# EAGLE design BasicGates2 (EAGLE 9.6.2)
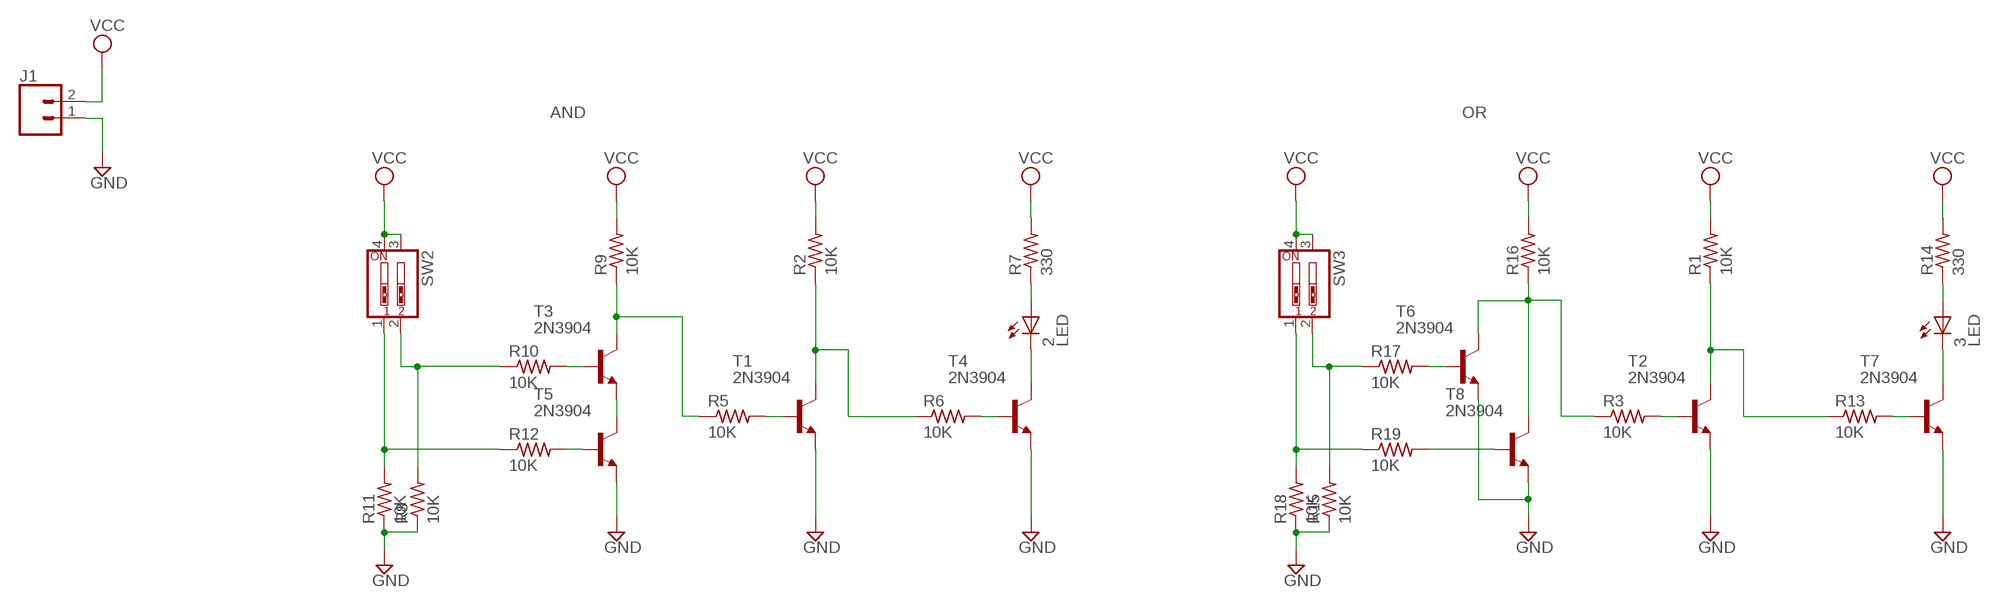
[diagram p0: schematic, sheet 1]

## Parts
2  LED  LED5MM  [LED5MM]
3  LED  LED5MM  [LED5MM]
J1  CONN_02  [1X02]
R1  10K  R-US_0309/10  [0309/10]
R2  10K  R-US_0309/10  [0309/10]
R3  10K  R-US_0309/10  [0309/10]
R5  10K  R-US_0309/10  [0309/10]
R6  10K  R-US_0309/10  [0309/10]
R7  330  R-US_0309/10  [0309/10]
R8  10K  R-US_0309/10  [0309/10]
R9  10K  R-US_0309/10  [0309/10]
R10  10K  R-US_0309/10  [0309/10]
R11  10K  R-US_0309/10  [0309/10]
R12  10K  R-US_0309/10  [0309/10]
R13  10K  R-US_0309/10  [0309/10]
R14  330  R-US_0309/10  [0309/10]
R15  10K  R-US_0309/10  [0309/10]
R16  10K  R-US_0309/10  [0309/10]
R17  10K  R-US_0309/10  [0309/10]
R18  10K  R-US_0309/10  [0309/10]
R19  10K  R-US_0309/10  [0309/10]
SW2  SW_DIP-2  [EDG-02]
SW3  SW_DIP-2  [EDG-02]
T1  2N3904  [TO92]
T2  2N3904  [TO92]
T3  2N3904  [TO92]
T4  2N3904  [TO92]
T5  2N3904  [TO92]
T6  2N3904  [TO92]
T7  2N3904  [TO92]
T8  2N3904  [TO92]

## Nets
GND: J1.1 R8.1 R11.1 R15.1 R18.1 T1.3(E) T2.3(E) T4.3(E) T5.3(E) T6.3(E) T7.3(E) T8.3(E)
N$1: R2.1 R6.1 T1.1(C)
N$2: R5.2 T1.2(B)
N$3: R1.1 R13.1 T2.1(C)
N$4: R6.2 T4.2(B)
N$5: 2.A R7.1
N$6: 2.K(C) T4.1(C)
N$7: R5.1 R9.1 T3.1(C)
N$8: R10.2 T3.2(B)
N$9: R8.2 R10.1 SW2.2
N$10: T3.3(E) T5.1(C)
N$11: R12.2 T5.2(B)
N$12: R11.2 R12.1 SW2.1
N$13: R13.2 T7.2(B)
N$14: 3.A R14.1
N$15: 3.K(C) T7.1(C)
N$16: R3.1 R16.1 T6.1(C) T8.1(C)
N$17: R17.2 T6.2(B)
N$18: R15.2 R17.1 SW3.2
N$19: R3.2 T2.2(B)
N$20: R19.2 T8.2(B)
N$21: R18.2 R19.1 SW3.1
VCC: J1.2 R1.2 R2.2 R7.2 R9.2 R14.2 R16.2 SW2.3 SW2.4 SW3.3 SW3.4

## Notes on the sheet
- AND | OR

## Library data of the parts
2 3 = led:LED: LED OSRAM: - CHIPLED LG R971, LG N971, LY N971, LG Q971, LY Q971, LO R971, LY R971 LH N974, LH R974 LS Q976, LO Q976, LY Q976 LO Q996 - Hyper CHIPLED LW Q18S LB Q993, LB Q99A, LB R99A - SideLED LS A670, LO A670, LY A670, LG A670, LP A670 LB A673, LV A673, LT A673, LW A673 LH A674 LY A675 LS A676, LA A676, LO A676, LY A676, LW A676 LS A679, LY A679, LG A679 - Hyper Micro SIDELED® LS Y876, LA Y876, LO Y876, LY Y876 LT Y87S - SmartLED LW L88C, LW L88S LB L89C, LB L89S, LG L890 LS L89K, LO L89K, LY L89K LS L896, LA L896, LO L896, LY L896 - TOPLED LS T670, LO T670, LY T670, LG T670, LP T670 LSG T670, LSP T670, LSY T670, LOP T670, LYG T670 LG T671, LOG T671, LSG T671 LB T673, LV T673, LT T673, LW T673 LH T674 LS T676, LA T676, LO T676, LY T676, LB T676, LH T676, LSB T676, LW T676 LB T67C, LV T67C, LT T67C, LS T67K, LO T67K, LY T67K, LW E67C LS E67B, LA E67B, LO E67B, LY E67B, LB E67C, LV E67C, LT E67C LW T67C LS T679, LY T679, LG T679 LS T770, LO T770, LY T770, LG T770, LP T770 LB T773, LV T773, LT T773, LW T773 LH T774 LS E675, LA E675, LY E675, LS T675 LS T776, LA T776, LO T776, LY T776, LB T776 LHGB T686 LT T68C, LB T68C - Hyper Mini TOPLED® LB M676 - Mini TOPLED Santana® LG M470 LS M47K, LO M47K, LY M47K Source: http://www.osram.convergy.de LUXEON: - LUMILED® LXK2-PW12-R00, LXK2-PW12-S00, LXK2-PW14-U00, LXK2-PW14-V00 LXK2-PM12-R00, LXK2-PM12-S00, LXK2-PM14-U00 LXK2-PE12-Q00, LXK2-PE12-R00, LXK2-PE12-S00, LXK2-PE14-T00, LXK2-PE14-U00 LXK2-PB12-K00, LXK2-PB12-L00, LXK2-PB12-M00, LXK2-PB14-N00, LXK2-PB14-P00, LXK2-PB14-Q00 LXK2-PR12-L00, LXK2-PR12-M00, LXK2-PR14-Q00, LXK2-PR14-R00 LXK2-PD12-Q00, LXK2-PD12-R00, LXK2-PD12-S00 LXK2-PH12-R00, LXK2-PH12-S00 LXK2-PL12-P00, LXK2-PL12-Q00, LXK2-PL12-R00 Source: www.luxeon.com KINGBRIGHT: KA-3528ASYC Source: www.kingbright.com
J1 = SparkFun-Connectors:CONN_02: Multi connection point. Often used as Generic Header-pin footprint for 0.1 inch spaced/style header connections On any of the 0.1 inch spaced packages, you can populate with these: Break Away Headers - Straight <https://www.sparkfun.com/products/116> (PRT-00116) Break Away Male Headers - Right Angle <https://www.sparkfun.com/products/553> (PRT-00553) Female Headers <https://www.sparkfun.com/products/115> (PRT-00115) Break Away Headers - Machine Pin <https://www.sparkfun.com/products/117> (PRT-00117) Break Away Female Headers - Swiss Machine Pin <https://www.sparkfun.com/products/743> (PRT-00743) For SCREWTERMINALS and SPRING TERMINALS visit here: Screw Terimnals on SparkFun.com <https://www.sparkfun.com/search/results?term=Screw+Terminals> (5mm/3.5mm/2.54mm spacing) This device is also useful as a general connection point to wire up your design to another part of your project. Our various solder wires solder well into these plated through hole pads. Hook-Up Wire - Assortment (Stranded, 22 AWG) <https://www.sparkfun.com/products/11375> (PRT-11375) Hook-Up Wire - Assortment (Solid Core, 22 AWG) <https://www.sparkfun.com/products/11367> (PRT-11367) View the entire wire category on our website here <https://www.sparkfun.com/categories/141> Special notes: Molex polarized connector foot print use with: PRT-08233 with associated crimp pins and housings. 2.54_SCREWTERM for use with PRT-10571. 3.5mm Screw Terminal footprints for PRT-08084 5mm Screw Terminal footprints for use with PRT-08432
R1-R3 R5-R19 = resistor:R-US_: RESISTOR, American symbol
SW2 SW3 = special:SW_DIP-2: DIP SWITCH
T1-T8 = transistor:2N3904: NPN TRANSISTOR

## Board
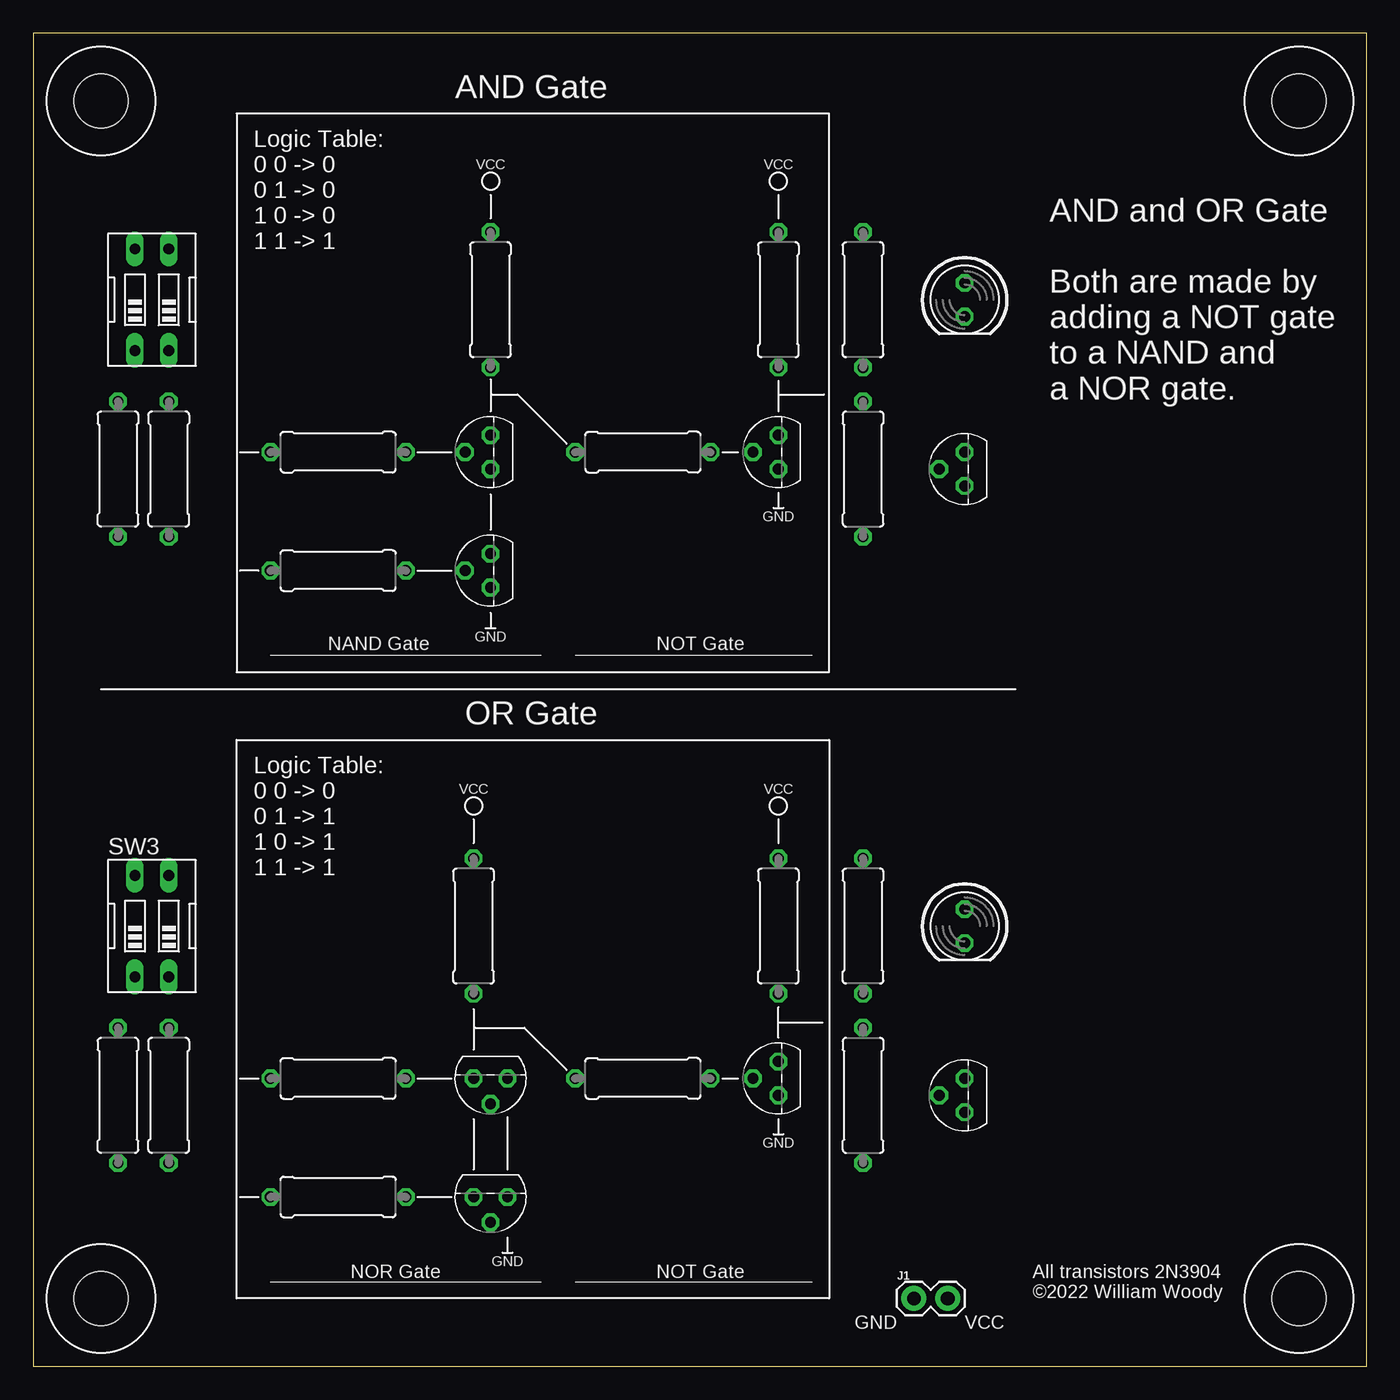
[diagram p1: board, top side]
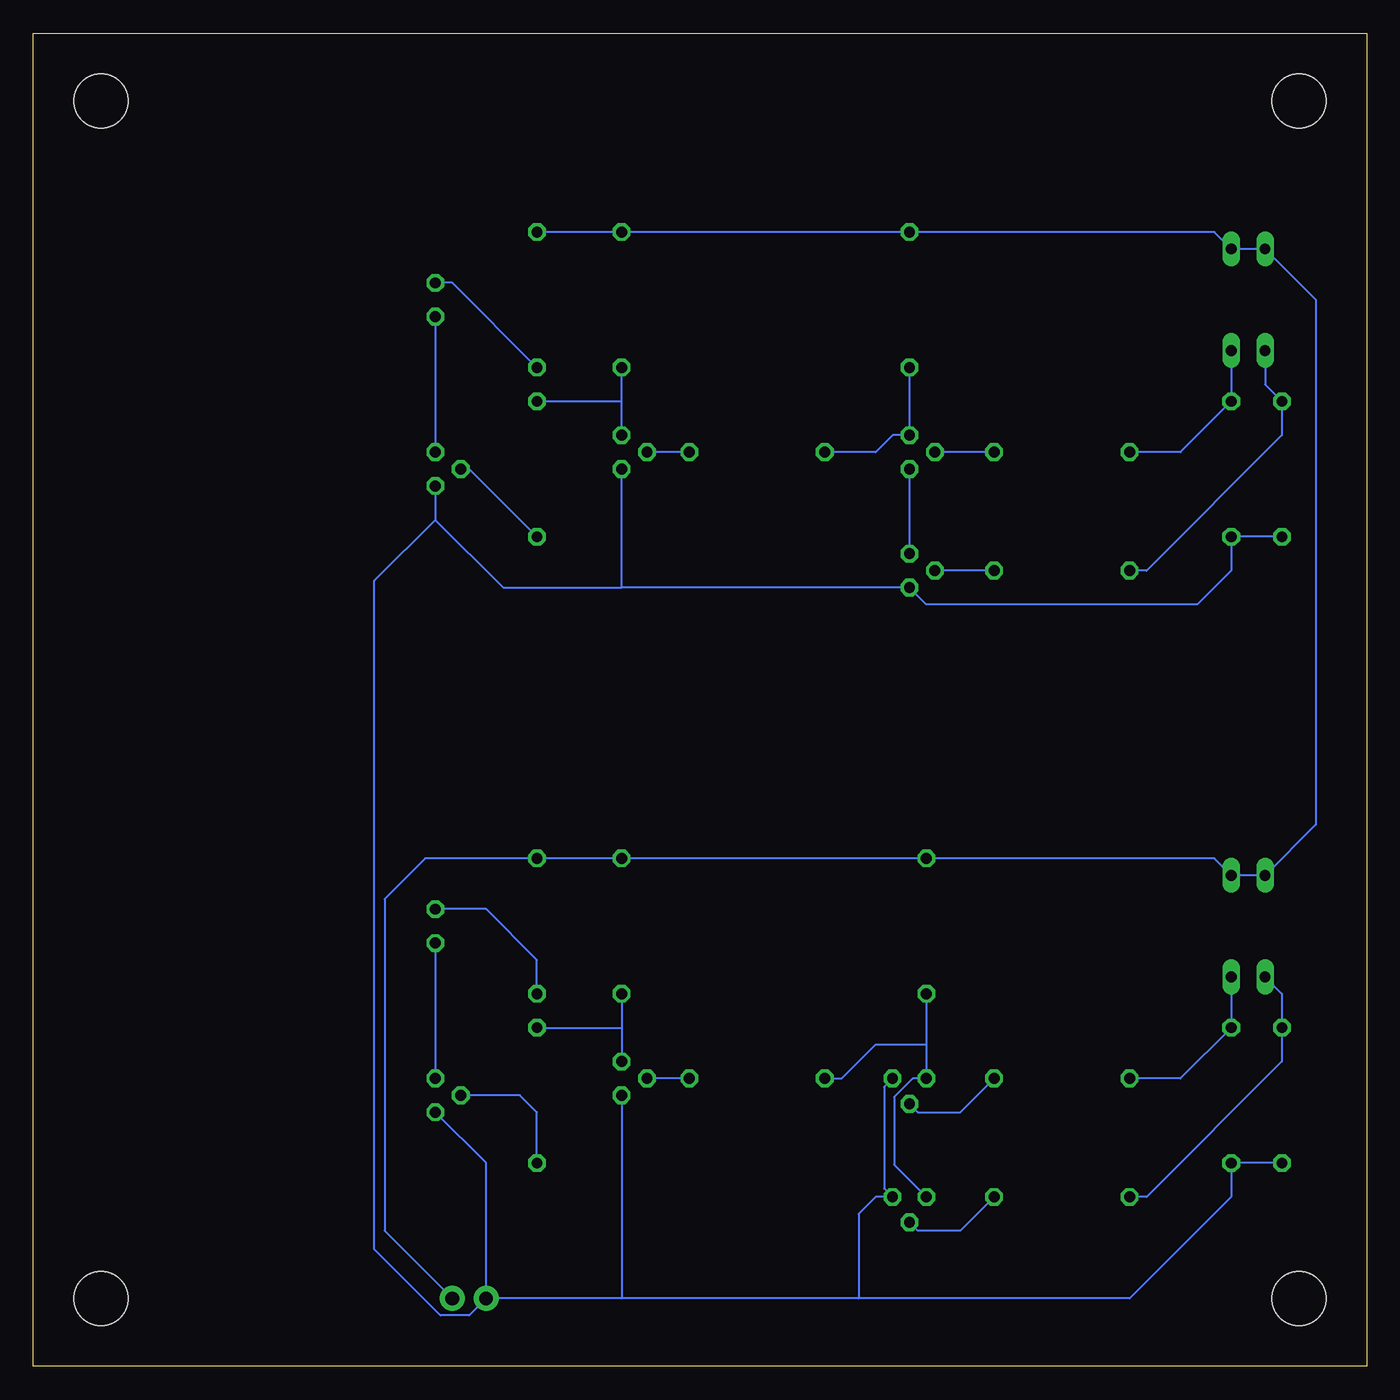
[diagram p2: board, bottom side, seen from below]

Size 100 x 100 mm. Coordinates in mm from the lower left corner, seen from the top.
Outline: 0,0 100,0 100,100 0,100 0,0
Copper layers (1*16): Top 0.035mm / dielectric 1.5mm / Bottom 0.035mm
Design rules "default": minimum track width 6mil, minimum drill 0.35mm, track to track 6mil, track to pad 6mil, pad to pad 6mil, via to via 6mil, smd to smd 6mil, copper to edge 40mil, drill to drill 6mil, minimum pad ring 10mil, minimum via ring 8mil, stop-mask expansion 4mil, vias tented up to drill 0mil, thermal gap 10mil
Holes 4.06 mm at 5.08,94.92 5.08,5.08 94.92,5.08 94.92,94.92

### Footprints (pad centres in the part's own frame; a part is rotated, then mirrored left to right if it is on the bottom)
LED5MM = drill 0.813 octagon: A -1.27,0; K 1.27,0
1X02 = drill 1.016 pad 1.88: 1 0,0; 2 2.54,0
0309/10 = drill 0.813 octagon: 1 -5.08,0; 2 5.08,0
EDG-02 = drill 0.813 long: 1 -1.27,-3.81; 2 1.27,-3.81; 3 1.27,3.81; 4 -1.27,3.81
TO92 = drill 0.813 octagon: 1 1.27,0; 2 0,1.905; 3 -1.27,0

### Placement (x,y rotation side)
2  69.85,80.01 270 top
3  69.85,33.02 270 top
J1  66.04,5.08 0 top
R1  55.88,33.02 90 top
R2  55.88,80.01 90 top
R3  45.72,21.59 0 top
R5  45.72,68.58 0 top
R6  62.23,67.31 270 top
R7  62.23,80.01 90 top
R8  10.16,67.31 90 top
R9  34.29,80.01 90 top
R10  22.86,68.58 0 top
R11  6.35,67.31 90 top
R12  22.86,59.69 0 top
R13  62.23,20.32 270 top
R14  62.23,33.02 90 top
R15  10.16,20.32 90 top
R16  33.02,33.02 90 top
R17  22.86,21.59 0 top
R18  6.35,20.32 90 top
R19  22.86,12.7 0 top
SW2  8.89,80.01 0 top
SW3  8.89,33.02 0 top
T1  55.88,68.58 90 top
T2  55.88,21.59 90 top
T3  34.29,68.58 90 top
T4  69.85,67.31 90 top
T5  34.29,59.69 90 top
T6  34.29,21.59 180 top
T7  69.85,20.32 90 top
T8  34.29,12.7 180 top

### Tracks (layer width: path | path; a pad name or v marks a point on that pad's centre or on a via)
GND
  Bottom 0.152: R11.1 R8.1 10.16,59.69 12.7,57.15 33.02,57.15 T5.3 55.88,58.42 | T4.3 69.85,63.5 | 69.85,63.5 64.77,58.42 55.88,58.42 | 55.88,58.42 T1.3 | R18.1 R15.1 10.16,12.7 17.78,5.08 38.1,5.08 | 38.1,5.08 55.88,5.08 | 55.88,5.08 J1.1 | J1.1 66.04,15.24 T7.3 | T2.3 55.88,5.08 | 38.1,5.08 38.1,11.43 36.83,12.7 T8.3 36.2,13.34 36.2,20.95 T6.3 | J1.1 67.31,3.81 69.47,3.81 74.42,8.76 74.42,58.93 69.85,63.5
N$1
  Bottom 0.152: T1.1 55.88,72.39 | 55.88,72.39 R2.1 | R6.1 55.88,72.39
N$2
  Bottom 0.152: R5.2 T1.2
N$3
  Bottom 0.152: R1.1 55.88,25.4 | 55.88,25.4 T2.1 | R13.1 55.88,25.4
N$4
  Bottom 0.152: R6.2 67.31,67.31 T4.2
N$5
  Bottom 0.152: R7.1 68.58,81.28 2.A
N$6
  Bottom 0.152: 2.K T4.1
N$7
  Bottom 0.152: R9.1 T3.1 35.56,69.85 36.83,68.58 R5.1
N$8
  Bottom 0.152: R10.2 T3.2
N$9
  Bottom 0.152: SW2.2 R8.2 13.97,68.58 R10.1
N$10
  Bottom 0.152: T3.3 T5.1
N$11
  Bottom 0.152: R12.2 T5.2
N$12
  Bottom 0.152: SW2.1 7.62,73.66 R11.2 6.35,69.85 16.51,59.69 R12.1
N$13
  Bottom 0.152: R13.2 62.23,19.05 63.5,20.32 T7.2
N$14
  Bottom 0.152: R14.1 62.23,30.48 66.04,34.29 3.A
N$15
  Bottom 0.152: 3.K T7.1
N$16
  Bottom 0.152: R3.1 39.37,21.59 36.83,24.13 33.02,24.13 | T8.1 35.43,15.11 35.43,20.19 34.04,21.59 T6.1 33.02,24.13 | R16.1 33.02,24.13
N$17
  Bottom 0.152: T6.2 33.66,19.05 30.48,19.05 R17.2
N$18
  Bottom 0.152: SW3.2 R15.2 13.97,21.59 R17.1
N$19
  Bottom 0.152: R3.2 T2.2
N$20
  Bottom 0.152: R19.2 30.48,10.16 33.66,10.16 T8.2
N$21
  Bottom 0.152: SW3.1 6.35,27.94 R18.2 6.35,22.86 16.51,12.7 R19.1
VCC
  Bottom 0.152: R7.2 R2.2 R9.2 11.43,85.09 SW2.3 SW2.4 3.81,80.01 3.81,40.64 SW3.4 SW3.3 11.43,38.1 R16.2 R1.2 R14.2 70.61,38.1 73.66,35.05 73.66,10.16 J1.2

### Text on the board
tNames: AND Gate | Logic Table: / 0 0 -> 0 / 0 1 -> 0 / 1 0 -> 0 / 1 1 -> 1 | VCC | VCC | AND and OR Gate / / Both are made by / adding a NOT gate / to a NAND and / a NOR gate. | GND | NAND Gate | GND | NOT Gate | OR Gate | Logic Table: / 0 0 -> 0 / 0 1 -> 1 / 1 0 -> 1 / 1 1 -> 1 | VCC | VCC | GND | All transistors 2N3904 / ©2022 William Woody | NOR Gate | GND | NOT Gate | GND | VCC